# EAGLE schematic Ideamart-NB-IoT-Air-Quality-Sensor-v1 (EAGLE 8.6.0)

## Sheet 1 of 3
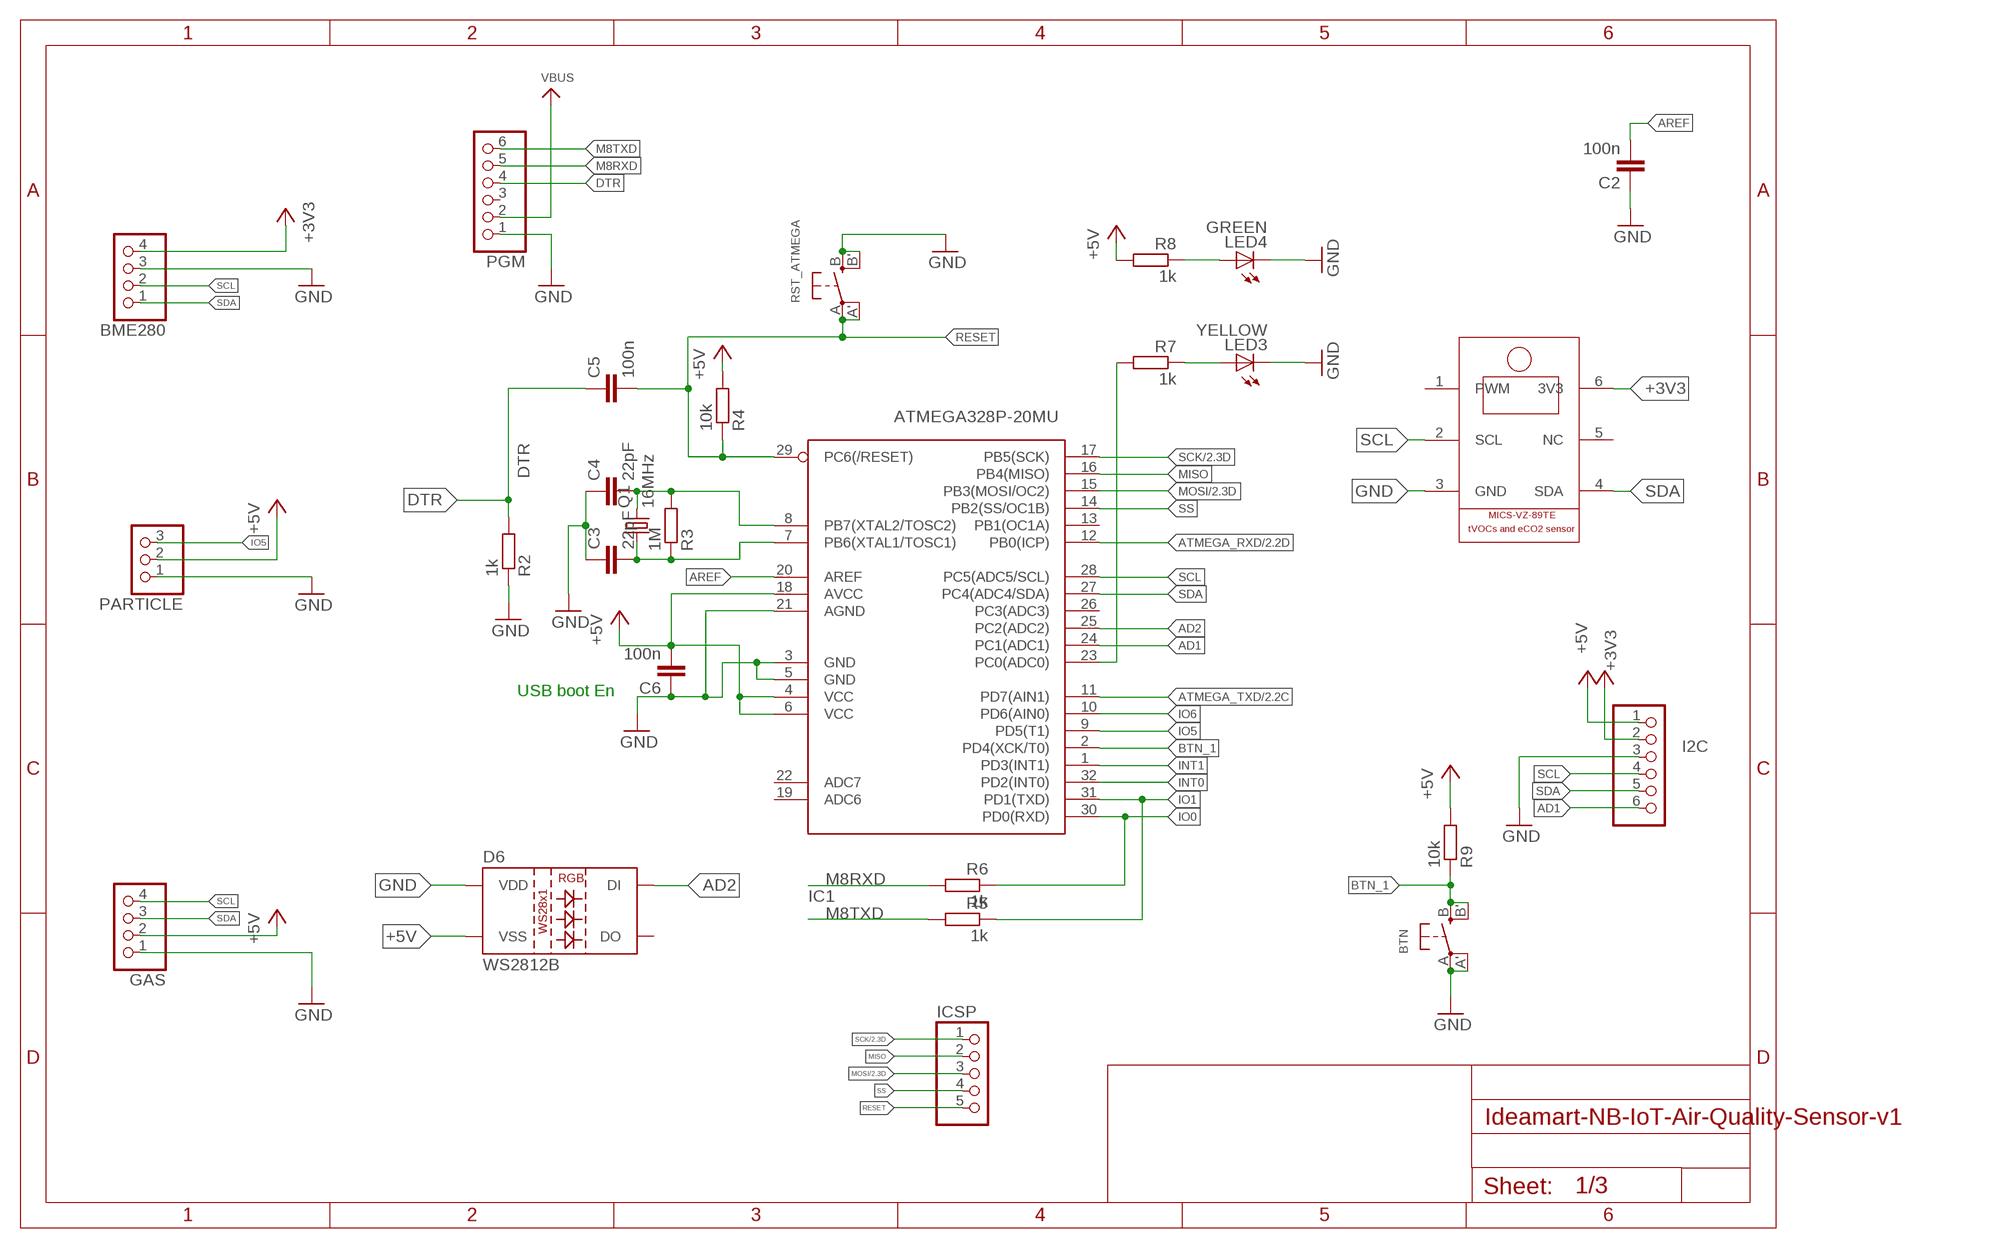
[diagram p0: schematic, sheet 1]

### Parts
BME280  PINHD-1X4  [1X04]
BTN  SWITCH_TACT_SMT4.6X2.8  [BTN_KMR2_4.6X2.8]
C2  100n  C-EUC0805  [C0805]
C3  22pF  C-EUC0805  [C0805]
C4  22pF  C-EUC0805  [C0805]
C5  100n  C-EUC0805  [C0805]
C6  100n  C-EUC0805  [C0805]
D6  WS2812B  [WS2812B]
GAS  PINHD-1X4  [1X04]
I2C  PINHD-1X6  [1X06]
IC1  ATMEGA328P-20MU  MEGA8-AI  [TQFP32-08]
ICSP  PINHD-1X5  [1X05]
LED3  YELLOW  LEDCHIP-LED0805  [CHIP-LED0805]
LED4  GREEN  LEDCHIP-LED0805  [CHIP-LED0805]
PARTICLE  PINHD-1X3  [1X03]
PGM  PINHD-1X6  [1X06]
Q1  16MHz  CRYSTALCTS406  [CTS406]
R2  1k  R-EU_R0805  [R0805]
R3  1M  R-EU_R0805  [R0805]
R4  10k  R-EU_R0805  [R0805]
R5  1k  R-EU_R0805  [R0805]
R6  1k  R-EU_R0805  [R0805]
R7  1k  R-EU_R0805  [R0805]
R8  1k  R-EU_R0805  [R0805]
R9  10k  R-EU_R0805  [R0805]
RST_ATMEGA  SWITCH_TACT_SMT4.6X2.8  [BTN_KMR2_4.6X2.8]
U$1  MICS-VZ-89TE  [MICS-VZ-89TE]

### Nets
+3V3: BME280.4 I2C.2 U$1.6(3V3) ; also sheet 3
+5V [usbvcc]: C6.2 D6.3(VSS) GAS.2 I2C.1 IC1.4(VCC) IC1.6(VCC) IC1.18(AVCC) PARTICLE.2 R4.2 R8.2 R9.2 ; also sheet 2,3
AD1: I2C.6 IC1.24(PC1(ADC1))
AD2: D6.4(DI) IC1.25(PC2(ADC2))
AREF [aref]: C2.2 IC1.20(AREF)
ATMEGA_RXD: IC1.12(PB0(ICP)) ; also sheet 2
ATMEGA_TXD: IC1.11(PD7(AIN1)) ; also sheet 2
BTN_1: BTN.B'(S1) BTN.B(S) IC1.2(PD4(XCK/T0)) R9.1
DTR: C5.1 PGM.4 R2.2
GND [gnd]: BME280.3 BTN.A'(P1) BTN.A(P) C2.1 C3.1 C4.1 C6.1 D6.1(VDD) GAS.1 I2C.3 IC1.3(GND) IC1.5(GND) IC1.21(AGND) LED3.C LED4.C PARTICLE.1 PGM.1 R2.1 RST_ATMEGA.B'(S1) RST_ATMEGA.B(S) U$1.3(GND) ; also sheet 2,3
INT0: IC1.32(PD2(INT0))
INT1: IC1.1(PD3(INT1))
IO0: IC1.30(PD0(RXD)) R6.1
IO1: IC1.31(PD1(TXD)) R5.1
IO5: IC1.9(PD5(T1)) PARTICLE.3
IO6: IC1.10(PD6(AIN0))
M8RXD: PGM.5 R6.2
M8TXD: PGM.6 R5.2
MISO: IC1.16(PB4(MISO)) ICSP.2
MOSI: IC1.15(PB3(MOSI/OC2)) ICSP.3 ; also sheet 2
N$1: LED3.A R7.1
N$3: LED4.A R8.1
N$23: IC1.23(PC0(ADC0)) R7.2
RESET: C5.2 IC1.29(PC6(/RESET)) ICSP.5 R4.1 RST_ATMEGA.A'(P1) RST_ATMEGA.A(P)
SCK: IC1.17(PB5(SCK)) ICSP.1 ; also sheet 2
SCL: BME280.2 GAS.4 I2C.4 IC1.28(PC5(ADC5/SCL)) U$1.2(SCL)
SDA: BME280.1 GAS.3 I2C.5 IC1.27(PC4(ADC4/SDA)) U$1.4(SDA)
SS: IC1.14(PB2(SS/OC1B)) ICSP.4
VBUS [usbvcc]: PGM.2 ; also sheet 2,3
XTAL1: C3.2 IC1.7(PB6(XTAL1/TOSC1)) Q1.1 R3.1
XTAL2: C4.2 IC1.8(PB7(XTAL2/TOSC2)) Q1.3 R3.2
Unconnected: D6.2(DO) IC1.13(PB1(OC1A)) IC1.19(ADC6) IC1.22(ADC7) IC1.26(PC3(ADC3)) PGM.3 U$1.1(PWM) U$1.5(NC)

### Notes on the sheet
- USB boot En

## Sheet 2 of 3
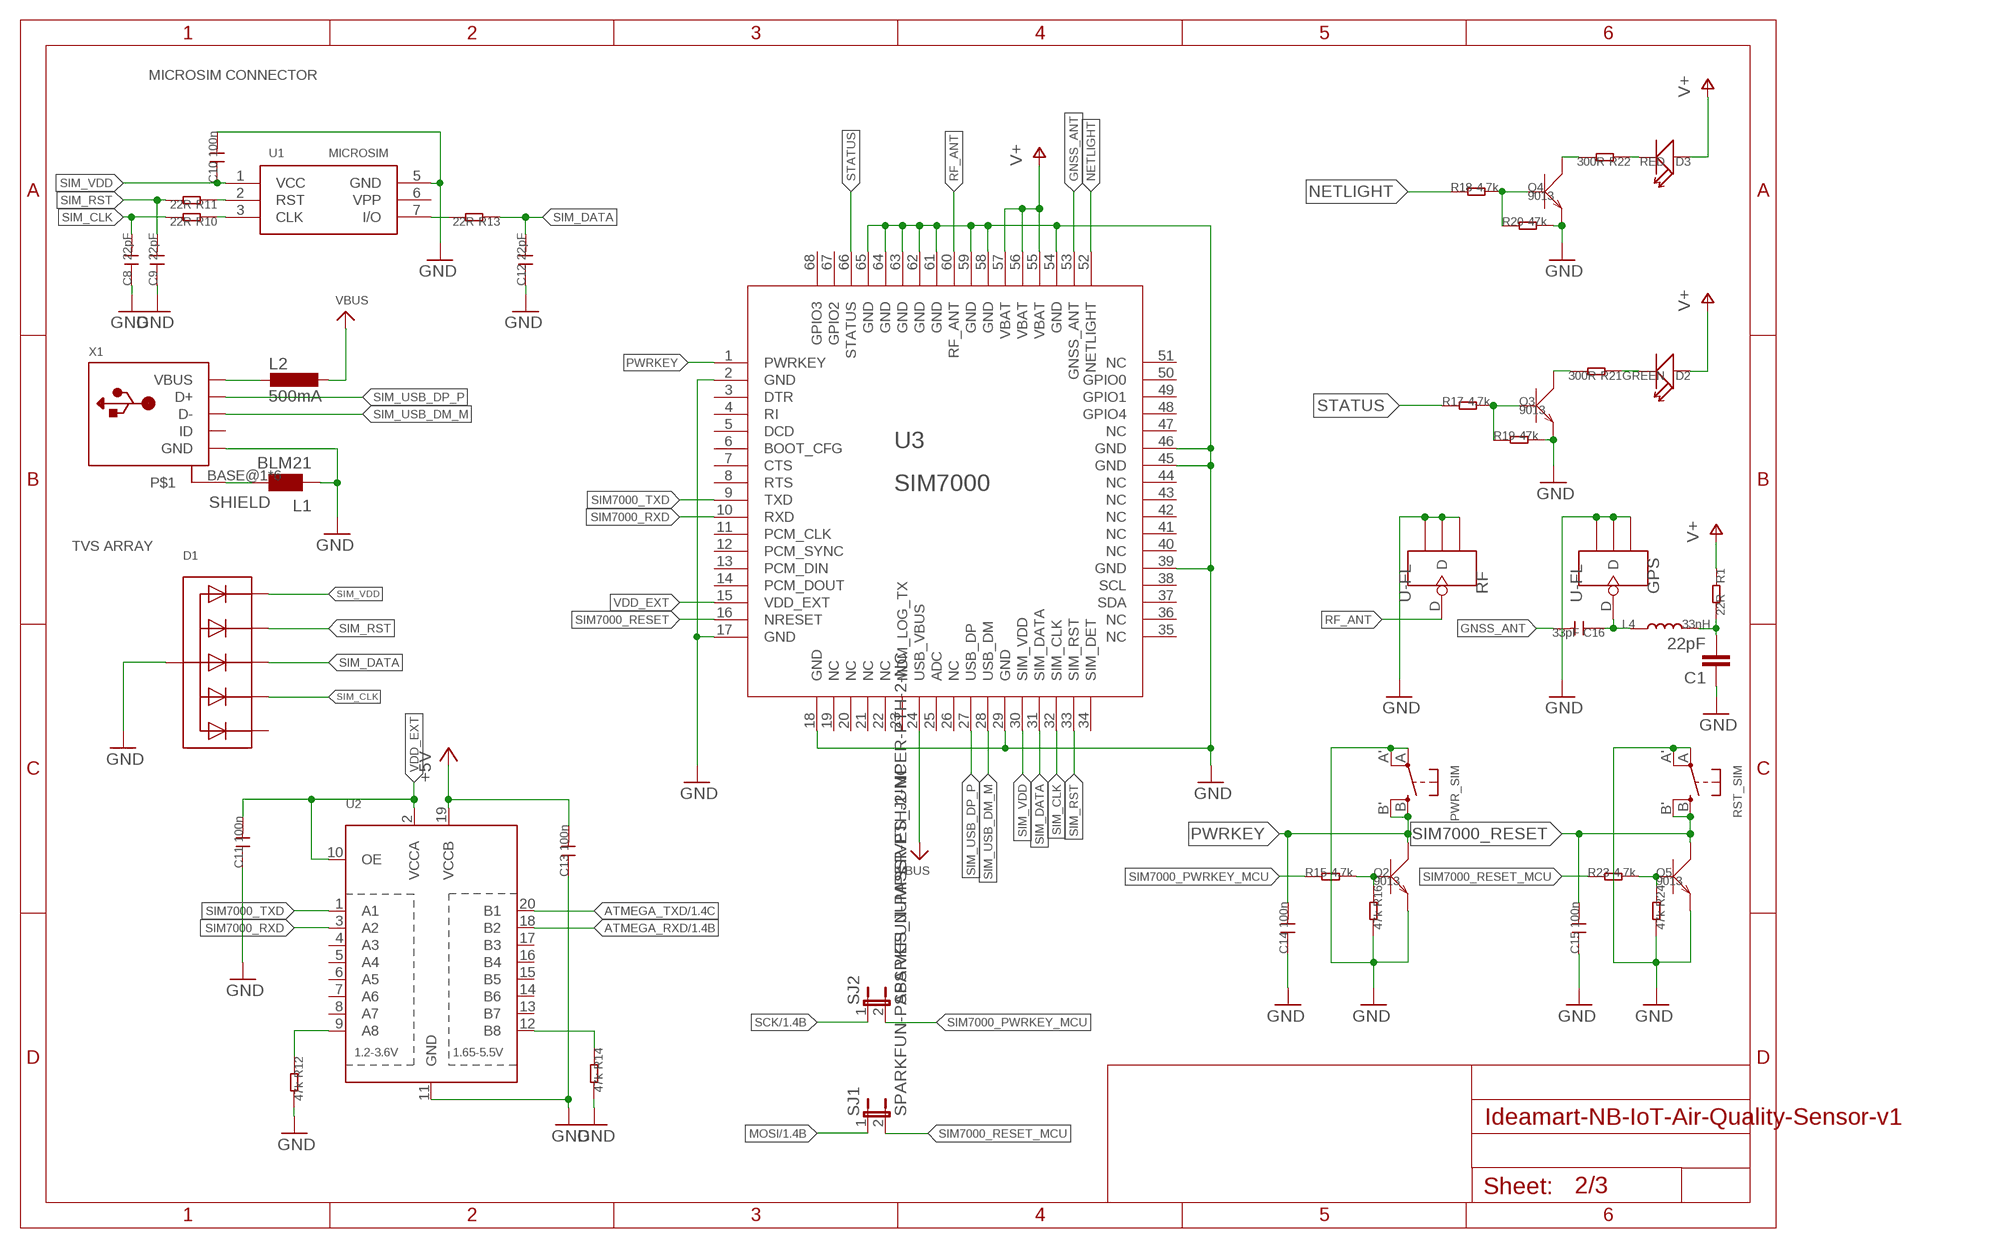
[diagram p1: schematic, sheet 2]

### Parts
C1  22pF  C-EUC0805  [C0805]
C8  22pF  C-0805  [0805]
C9  22pF  C-0805  [0805]
C10  100n  C-0805  [0805]
C11  100n  C-0805  [0805]
C12  22pF  C-0805  [0805]
C13  100n  C-0805  [0805]
C14  100n  C-0805  [0805]
C15  100n  C-0805  [0805]
C16  33pF  C-0805  [0805]
D1  TVSARRAY_5LANE  [SOT363]
D2  GREEN  LED'0805'  [LED-0805]
D3  RED  LED'0805'  [LED-0805]
GPS  U-FL  ANTENNA-U-FL  [4P-U-FL]
L1  BLM21  WE-CBF_0805  [0805]
L2  500mA  L-EUL1812  [L1812]
L4  33nH  L0805  [L0805]
PWR_SIM  SWITCH_TACT_SMT4.6X2.8  [BTN_KMR2_4.6X2.8]
Q2  9013  TRANSISTOR-NPN-SOT23  [SOT23]
Q3  9013  TRANSISTOR-NPN-SOT23  [SOT23]
Q4  9013  TRANSISTOR-NPN-SOT23  [SOT23]
Q5  9013  TRANSISTOR-NPN-SOT23  [SOT23]
R1  22R  R-0805  [0805]
R10  22R  R-0805  [0805]
R11  22R  R-0805  [0805]
R12  47k  R-0805  [0805]
R13  22R  R-0805  [0805]
R14  47k  R-0805  [0805]
R15  4.7k  R-0805  [0805]
R16  47k  R-0805  [0805]
R17  4.7k  R-0805  [0805]
R18  4.7k  R-0805  [0805]
R19  47k  R-0805  [0805]
R20  47k  R-0805  [0805]
R21  300R  R-0805  [0805]
R22  300R  R-0805  [0805]
R23  4.7k  R-0805  [0805]
R24  47k  R-0805  [0805]
RF  U-FL  ANTENNA-U-FL  [4P-U-FL]
RST_SIM  SWITCH_TACT_SMT4.6X2.8  [BTN_KMR2_4.6X2.8]
SJ1  SPARKFUN-PASSIVES_JUMPER-PTH-2-NC  [SPARKFUN-PASSIVES_PTH-JUMPER-NC_BOTTOM_NO_SILK]
SJ2  SPARKFUN-PASSIVES_JUMPER-PTH-2-NC  [SPARKFUN-PASSIVES_PTH-JUMPER-NC_BOTTOM_NO_SILK]
U1  MICROSIM  [MICROSIM]
U2  TXB0108PWR  [TSSOP20]
U3  SIM7000  [SIM7000]
X1  USB_MICRO_20329_V2  [4UCONN_20329_V2]

### Nets
+5V [usbvcc]: C13.2 U2.19(VCCB) ; also sheet 1,3
ATMEGA_RXD: U2.18(B2) ; also sheet 1
ATMEGA_TXD: U2.20(B1) ; also sheet 1
GND [gnd]: C1.1 C8.1 C9.1 C10.2 C11.1 C12.1 C13.1 C14.1 C15.1 D1.2(A) GPS.GND1 GPS.GND2 GPS.GND3 L1.1 PWR_SIM.A'(P1) PWR_SIM.A(P) Q2.2(E) Q3.2(E) Q4.2(E) Q5.2(E) R12.2 R14.2 R16.2 R19.2 R20.2 R24.2 RF.GND1 RF.GND2 RF.GND3 RST_SIM.A'(P1) RST_SIM.A(P) U1.5(GND) U2.11(GND) U3.2(GND) U3.17(GND) U3.18(GND) U3.29(GND) U3.39(GND) U3.45(GND) U3.46(GND) U3.54(GND) U3.58(GND) U3.59(GND) U3.61(GND) U3.62(GND) U3.63(GND) U3.64(GND) U3.65(GND) X1.GND ; also sheet 1,3
GNSS_ANT [ant]: C16.2 U3.53(GNSS_ANT)
MOSI: SJ1.1 ; also sheet 1
N$6: Q3.3(C) R21.2
N$7: D2.- R21.1
N$8: Q3.1(B) R17.2 R19.1
N$10: R13.2 U1.7(I/O)
N$12: R10.1 U1.3(CLK)
N$13: R11.1 U1.2(RST)
N$14: Q5.1(B) R23.2 R24.1
N$15: L2.2 X1.VBUS
N$16: Q4.3(C) R22.2
N$17: D3.- R22.1
N$18: Q4.1(B) R18.2 R20.1
N$19 [ant]: C16.1 GPS.D L4.1
N$20: R12.1 U2.9(A8)
N$21: R14.1 U2.12(B8)
N$29: C1.2 L4.2 R1.2
N$36: Q2.1(B) R15.2 R16.1
NETLIGHT: R18.1 U3.52(NETLIGHT)
PWRKEY: C14.2 PWR_SIM.B'(S1) PWR_SIM.B(S) Q2.3(C) U3.1(PWRKEY)
RF_ANT [ant]: RF.D U3.60(RF_ANT)
SCK: SJ2.1 ; also sheet 1
SHIELD: L1.2 X1.BASE@1 X1.BASE@2 X1.SPRT@1 X1.SPRT@2 X1.SPRT@3 X1.SPRT@4
SIM7000_PWRKEY_MCU: R15.1 SJ2.2
SIM7000_RESET: C15.2 Q5.3(C) RST_SIM.B'(S1) RST_SIM.B(S) U3.16(NRESET)
SIM7000_RESET_MCU: R23.1 SJ1.2
SIM7000_RXD: U2.3(A2) U3.10(RXD)
SIM7000_TXD: U2.1(A1) U3.9(TXD)
SIM_CLK: C8.2 D1.5(C4) R10.2 U3.32(SIM_CLK)
SIM_DATA: C12.2 D1.4(C3) R13.1 U3.31(SIM_DATA)
SIM_RST: C9.2 D1.3(C2) R11.2 U3.33(SIM_RST)
SIM_USB_DM_M: U3.28(USB_DM) X1.D-
SIM_USB_DP_P: U3.27(USB_DP) X1.D+
SIM_VDD: C10.1 D1.1(C1) U1.1(VCC) U3.30(SIM_VDD)
STATUS: R17.1 U3.66(STATUS)
V+: D2.+ D3.+ R1.1 U3.55(VBAT) U3.56(VBAT) U3.57(VBAT) ; also sheet 3
VBUS [usbvcc]: L2.1 U3.24(USB_VBUS) ; also sheet 1,3
VDD_EXT: C11.2 U2.2(VCCA) U2.10(OE) U3.15(VDD_EXT)
Unconnected: D1.6(C5) U1.6(VPP) U2.4(A3) U2.5(A4) U2.6(A5) U2.7(A6) U2.8(A7) U2.13(B7) U2.14(B6) U2.15(B5) U2.16(B4) U2.17(B3) U3.3(DTR) U3.4(RI) U3.5(DCD) U3.6(BOOT_CFG) U3.7(CTS) U3.8(RTS) U3.11(PCM_CLK) U3.12(PCM_SYNC) U3.13(PCM_DIN) U3.14(PCM_DOUT) U3.19(NC) U3.20(NC) U3.21(NC) U3.22(NC) U3.23(MDM_LOG_TX) U3.25(ADC) U3.26(NC) U3.34(SIM_DET) U3.35(NC) U3.36(NC) U3.37(SDA) U3.38(SCL) U3.40(NC) U3.41(NC) U3.42(NC) U3.43(NC) U3.44(NC) U3.47(NC) U3.48(GPIO4) U3.49(GPIO1) U3.50(GPIO0) U3.51(NC) X1.ID

### Notes on the sheet
- MICROSIM CONNECTOR
- TVS ARRAY

## Sheet 3 of 3
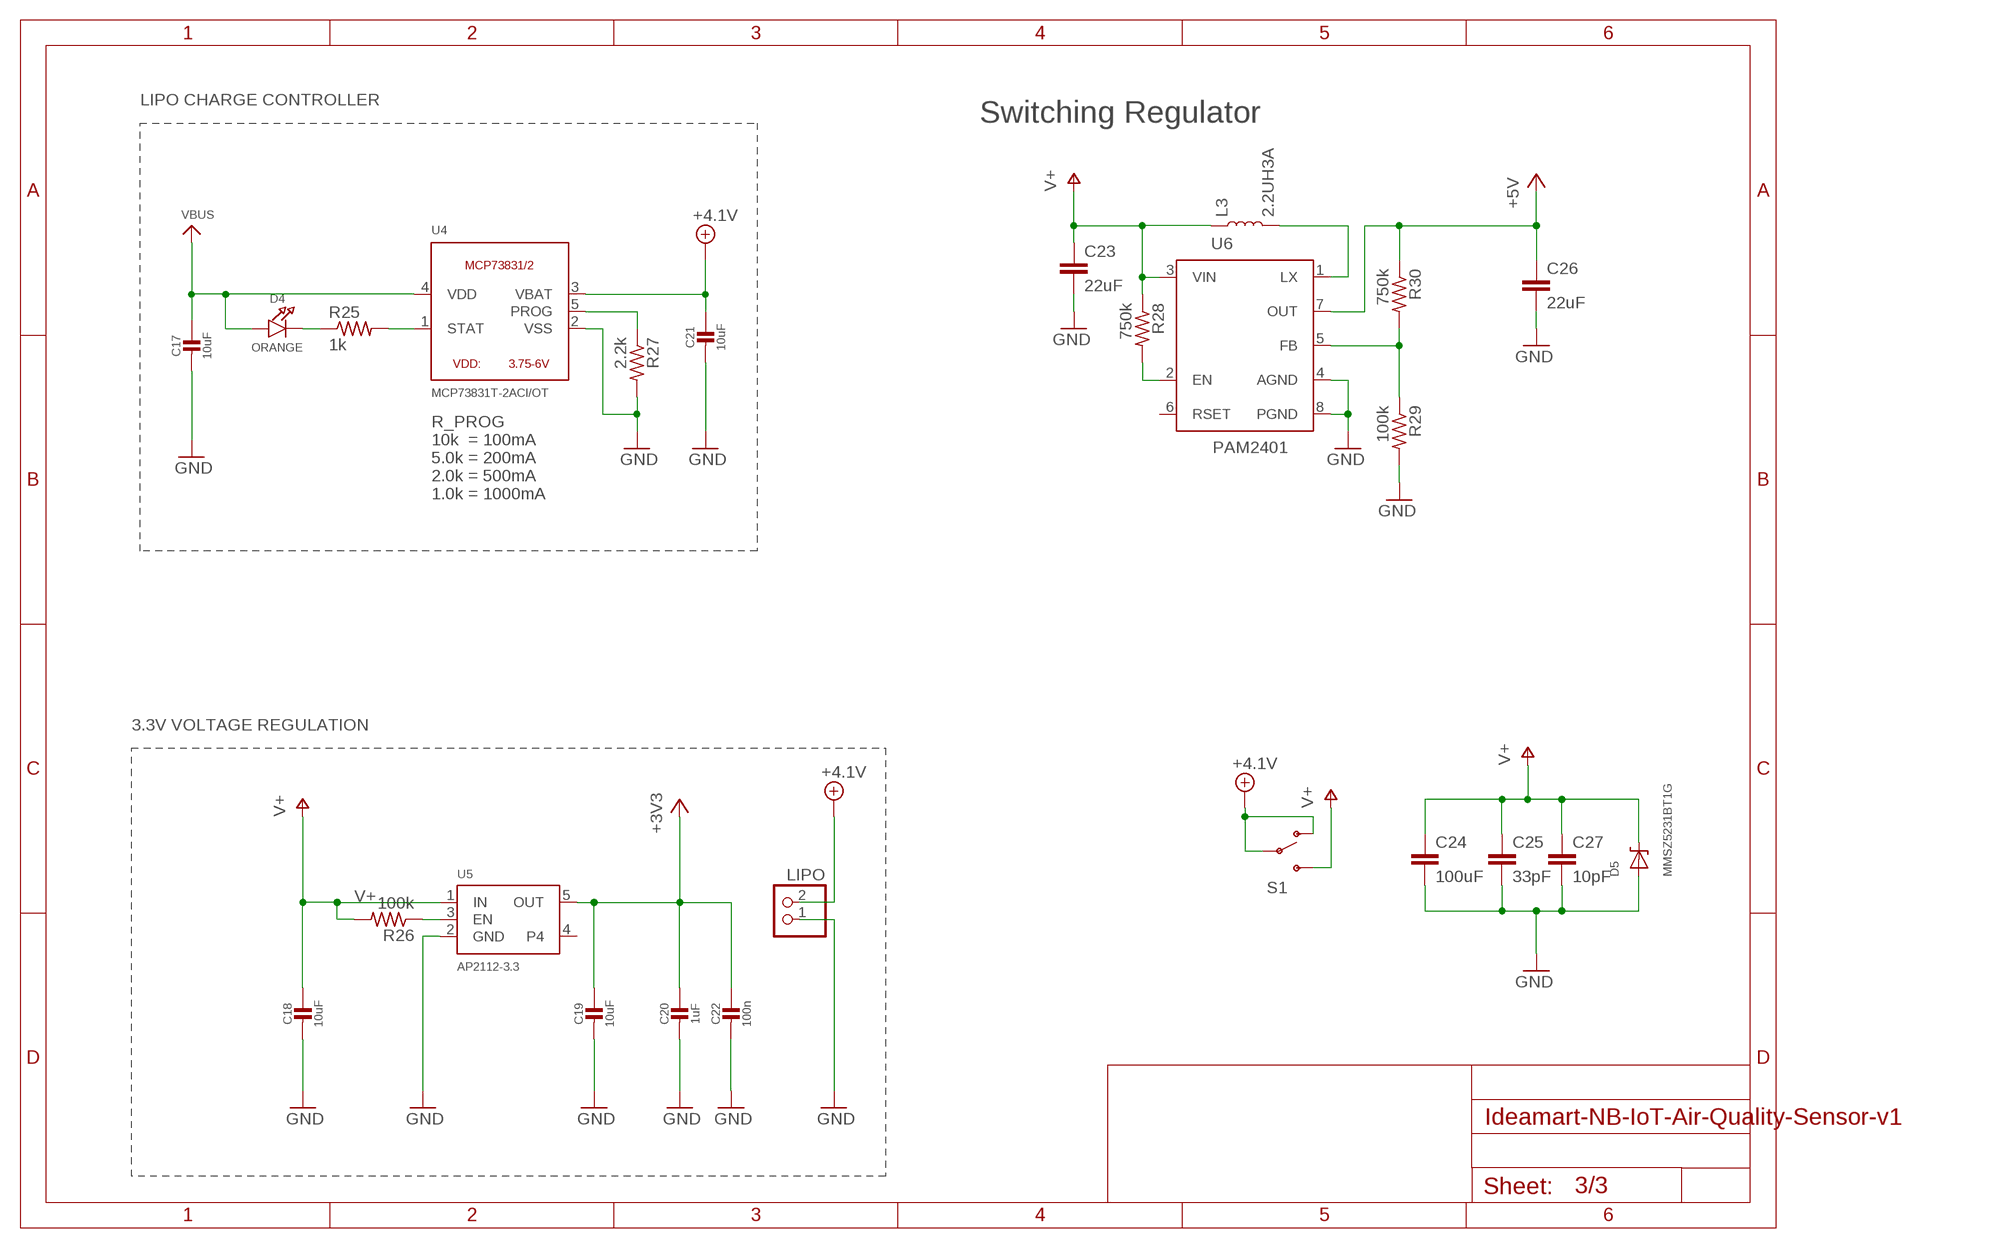
[diagram p2: schematic, sheet 3]

### Parts
C17  10uF  CAP_CERAMIC_0805  [_0805]
C18  10uF  CAP_CERAMIC_0805MP  [_0805MP]
C19  10uF  CAP_CERAMIC_0805MP  [_0805MP]
C20  1uF  CAP_CERAMIC_0805MP  [_0805MP]
C21  10uF  CAP_CERAMIC_0805  [_0805]
C22  100n  CAP_CERAMIC_0805MP  [_0805MP]
C23  22uF  22UF-0805-6.3V-20%  [0805]
C24  100uF  22UF-1210-16V-20%  [1210]
C25  33pF  22UF-0805-6.3V-20%  [0805]
C26  22uF  22UF-0805-6.3V-20%  [0805]
C27  10pF  22UF-0805-6.3V-20%  [0805]
D4  ORANGE  LED0805  [CHIPLED_0805]
D5  MMSZ5231BT1G  DIODE-ZENERSOD123  [SOD-123]
L3  2.2UH3A  INDUCTOR-IFSC1515AHER2R2M01  [INDUCTOR_4X4MM]
LIPO  JST_2PIN-SMT  [JST-PH-2-SMT]
R25  1k  R-US_M0805  [M0805]
R26  100k  R-US_M0805  [M0805]
R27  2.2k  R-US_M0805  [M0805]
R28  750k  R-US_M0805  [M0805]
R29  100k  R-US_M0805  [M0805]
R30  750k  R-US_M0805  [M0805]
S1  SWITCH-SPDT-SMD-A  [SWITCH-SPST-SMD-A]
U4  MCP73831T-2ACI/OT  MCP73831/2  [SOT23-5]
U5  AP2112-3.3  VREG_SOT23-5  [SOT23-5]
U6  PAM2401  [MSOP8]

### Nets
+3V3: C19.1 C20.1 C22.1 U5.5(OUT) ; also sheet 1
+4.1V: C21.1 LIPO.2 S1.1(O) S1.2(P) U4.3(VBAT)
+5V [usbvcc]: C26.1 R30.1 U6.7(OUT) ; also sheet 1,2
EN: R28.2 U6.2(EN)
GND [gnd]: C17.2 C18.2 C19.2 C20.2 C21.2 C22.2 C23.2 C24.2 C25.2 C26.2 C27.2 D5.A LIPO.1 R27.2 R29.2 U4.2(VSS) U5.2(GND) U6.4(AGND) U6.8(PGND) ; also sheet 1,2
N$2: R26.1 U5.3(EN)
N$4: D4.C R25.1
N$5: R25.2 U4.1(STAT)
N$9: R27.1 U4.5(PROG)
N$11: R29.1 R30.2 U6.5(FB)
N$22: L3.P$2 U6.1(LX)
V+: C18.1 C23.1 C24.1 C25.1 C27.1 D5.C L3.P$1 R26.2 R28.1 S1.3(S) U5.1(IN) U6.3(VIN) ; also sheet 2
VBUS [usbvcc]: C17.1 D4.A U4.4(VDD) ; also sheet 1,2
Unconnected: U5.4 U6.6(RSET)

### Notes on the sheet
- LIPO CHARGE CONTROLLER
- Switching Regulator
- R_PROG
  10k  = 100mA
  5.0k = 200mA
  2.0k = 500mA
  1.0k = 1000mA
- 3.3V VOLTAGE REGULATION

## Power pins joined to a net without a drawn wire
GPIO2: U3.67(GPIO2)
GPIO3: U3.68(GPIO3)

## Library data of the parts
BME280 GAS = pinhead:PINHD-1X4: PIN HEADER
BTN PWR_SIM RST_ATMEGA RST_SIM = Adafruit111:SWITCH_TACT_SMT: SMT Tact Switches 6x6mm - Digikey: P12940SCT-ND KMR2 (4.6x2.8mm) - Digikey: 401-1426-1-ND EVQ-PQHB55 - Light Touch, 160GF (4.5x4.5mm) - Digikey: P8090SCT-ND KMT0 - KMT021 NGJ LHS (etc.) IP68/Waterproof - Digikey: CKN10289CT-ND
C1-C6 = SmartPrj:C-EU: CAPACITOR, European symbol
C8-C16 = discrete:C*: Ceramic Capacitors
C17-C22 = Adafruit111:CAP_CERAMIC: Ceramic Capacitors For new designs, use the packages preceded by an '_' character since they are more reliable: The following footprints should be used on most boards: _0402 - Standard footprint for regular board layouts _0603 - Standard footprint for regular board layouts _0805 - Standard footprint for regular board layouts _1206 - Standard footprint for regular board layouts For extremely tight-pitch boards where space is at a premium, the following 'micro-pitch' footprints can be used (smaller pads, no silkscreen outline, etc.): _0402MP - Micro-pitch footprint for very dense/compact boards _0603MP - Micro-pitch footprint for very dense/compact boards _0805MP - Micro-pitch footprint for very dense/compact boards _1206MP - Micro-pitch footprint for very dense/compact boards
C23 C26 = SparkFun-Capacitors:22UF: 22µF ceramic capacitors A capacitor is a passive two-terminal electrical component used to store electrical energy temporarily in an electric field.; PROD_ID: CAP-08402
C24 = SparkFun-Capacitors:22UF: 22µF ceramic capacitors A capacitor is a passive two-terminal electrical component used to store electrical energy temporarily in an electric field.
C25 C27 = SparkFun-Capacitors:22UF: 22µF ceramic capacitors A capacitor is a passive two-terminal electrical component used to store electrical energy temporarily in an electric field.; PROD_ID: CAP-08402; VALUE: 22uF
D1 = Adafruit SIM808 Breakout:TVSARRAY_5LANE: Voltage Transient Suppressor Array SOT363 SMF05C - 100W 5V: Digikey - SMF05CT1GOSCT-ND
D2 D3 = discrete:LED*
D4 = LED-adafruit:LED: LED
D5 = Adafruit SIM808 Breakout:DIODE-ZENER: Zener Diode SMA: 30V 1W Zener Diode, 1.2Vf - Digikey: SMAZ30-FDICT-ND
D6 = SparkFun-LED:WS2812B: WS2812B SMD addressable RGB LED 5x5mm SMD LED with built-in controller IC. Color: Red/Green/Blue mC Rating: RGB: 390, 660, 180 mcd Forward Voltage: RGB: 2.0, 3.0, 3.0 V Packages:WS2812B SparkFun Products: Blynk Board - ESP8266 <https://www.sparkfun.com/products/13794>; PROD_ID: DIO-12503
GPS RF = Connector:ANTENNA-U-FL
I2C PGM = pinhead:PINHD-1X6: PIN HEADER
IC1 = idii:MEGA8: MICROCONTROLLER 8 Kbytes FLASH 1 kbytes SRAM 512 bytes EEPROM USART 6-channel 10 bit ADC 2-channel 8 bit ADC Source: avr.lbr
ICSP = pinhead:PINHD-1X5: PIN HEADER
L1 = wuerth-elektronik:WE-CBF: SMD EMI Suppression Ferrite Beads - excellent anti-EMI properties - low DCR - impedances till 3000 ohms - rated current up to 6 A
L2 = rcl:L-EU: INDUCTOR, European symbol; SPICEPREFIX: L
L3 = SparkFun-Coils:INDUCTOR: Inductors Resist changes in electrical current. Basically a coil of wire. SparkFun Products: SparkFun Load Cell Amplifier - HX711 <https://www.sparkfun.com/products/13879> IOIO-OTG - V2.2 <https://www.sparkfun.com/products/13613>; PROD_ID: NDUC-13770
L4 = GPRS+GSM+GPS Shield v1.0:L*
LED3 LED4 = led:LED: LED
LIPO = adafruit:JST_2PIN: JST 2-Pin Connectors of various flavors SMT-RA (S2B-PH-SM4) 4UConnector #17311 SMT (B2B-PH-SM4) THM-RA (S2B-PH) THM (B2B-PH)
PARTICLE = pinhead:PINHD-1X3: PIN HEADER
Q1 = crystal:CRYSTAL: CRYSTAL; OC_FARNELL: unknown; OC_NEWARK: unknown
Q2-Q5 = discrete:TRANSISTOR-NPN*: NPN audion
R1 R10-R24 = discrete:R*
R2-R9 = SmartPrj:R-EU_: RESISTOR, European symbol
R25-R30 = resistor:R-US_: RESISTOR, American symbol
S1 = SparkFun-Electromechanical:SWITCH-SPDT: SPDT Switch Simple slide switch, Spark Fun Electronics SKU : COM-00102 DPDT SMT slide switch, AYZ0202, SWCH-08179; PROD_ID: SWCH-10651
SJ1 SJ2 = ESP8266_Sparkfun:SPARKFUN-PASSIVES_JUMPER-PTH-2-NC
U1 = GPRS+GSM+GPS Shield v1.0:MICROSIM
U2 = adafruit:TXB0108PWR: 8-Bit Bi-Directional Level Shifter 1.2V-3.6V (VCCA) to 1.65V-5.5V (VCCB) bi-directional level shifter with auto direction sensing. Max data rate - VCCA 1.8V: 20Mbps (50ns), VCCA 3.3V: 100Mbps (10ns) Digikey: 296-21527-1-ND
U3 = ICs_v54:SIM7000
U4 = MCP73831:MCP73831/2: MCP73831/2 LIPO Charger VDD: 3.75 - 6V Temp -40 - 85°C Programmable Charge Rate: 15-500mA NOTE: STAT is a tri-state logic output on the MCP73831 and an open-drain output on the MCP73832. SOT23-5 with 4.2V output and tri-state logic on STAT = MCP73831T-2ACI/OT
U5 = AP2112 3.3 Reg:VREG_SOT23-5: SOT23-5 Fixed Voltage Regulators Part Current Out V Out V In V Dropout ?JA (°C/W) TJ (°C) Digikey Part No. ADP121 150mA 3.3V 3.4-5.5V 0.09V @ 150mA -- -- ADP121-AUJZ33R7CT-ND ADP121 150mA 3.0V 3.1-5.5V 0.09V @ 150mA -- -- ADP121-AUJZ30R7CT-ND ADP122 300mA 3.3V 3.4-5.5V 0.085V @ 300mA -- -- ADP122AUJZ-3.3-R7CT-ND ADP1712 300mA 3.3V 3.5-5.5V 0.17V @ 300mA -- -- ADP1712AUJZ-3.3-R7TR-ND AP7311 (Low Cost) 150mA 3.3V 3.5-6V 0.15V @ 150mA -- -- AP7311-33WG-7DICT-ND LD39015M18R 150mA 1.8V 1.9V-5.5V 0.08V @ 100mA -- -- 497-6977-1-ND LP2985A-33DBVR 150mA 3.3V 3.3-16V 0.28V @ 150mA 206 150 296-18479-1-ND MCP1824T-3302E/OT 300mA 3.3V 3.5V-6V 0.2V @ 300mA -- -- MCP1824T-3302E/OTCT-ND MIC5205-2.5YM5 TR 150mA 2.5V 2.7-16V 0.165V @ 150mA -- -- 576-1257-2-ND MIC5205-3.0YM5 TR 150mA 3.0V 3.2V-16V 0.165V @ 150mA -- -- 576-1258-2-ND MIC5205-3.3YM5 TR 150mA 3.3V 3.5V-16V 0.165V @ 150mA -- -- 576-1259-2-ND TPS780330220 150mA 3.3V+2.2V 3.6-5.5V 250mV Max -- -- 296-23332-1-ND TDA3663/N1,135 100mA 3.3V 3.5-45V 0.18V @ 50mA -- -- 568-5343-1-ND Max operating temp can be calculated using ?JA, TJ (max junction temperature), and power in watts. Set the "Maximum Ambient Temperature" until it reaches TJ ("Max Junction Temperature"), which is the absolute limit for safe use of the regulator: Heat Sink Temperature Calculator <http://www.daycounter.com/Calculators/Heat-Sink-Temperature-Calculator.phtml> For example, With 12V source into a 3.3V LP2985 and a 30mA load, we are dissipating (12V-3.3V) * 0.03A = 0.261W. With a ?JA of 206 °C/W, a TJ of 150°C, and 261mW we can safely use the chip without a heat sink up to 75°C (=147.1°C Junction Temperature).
U6 = SparkFun-IC-Power:PAM2401: PAM2401 - Boost PMIC Specifications: Up to 1A output current 0.9V to 4.75V Input Range 2.5V to 5.0V Adjustable Output Voltage Datasheet <https://www.diodes.com/assets/Datasheets/PAM2401.pdf> (Diodes inc.); PROD_ID: IC-13769
U$1 = MICS-VZ-89TE:MICS-VZ-89TE
X1 = Adafruit SIM808 Breakout:USB: USB Connectors USBMINIB - Surface Mount Female Mini-B USB Connector 4UConnector: 06564

## Net classes
1 power: width 0.406 mm, drill 0.356 mm, clearance 0.152 mm
2 gnd: width 0.203 mm, drill 0.356 mm, clearance 0.152 mm
3 usbvcc: width 0.203 mm, drill 0.356 mm, clearance 0.152 mm
4 aref: width 0.203 mm, drill 0.356 mm, clearance 0.152 mm
5 ant: width 0.33 mm, clearance 0.66 mm